# Altium schematic sheet Connectors.SchDoc
size A4
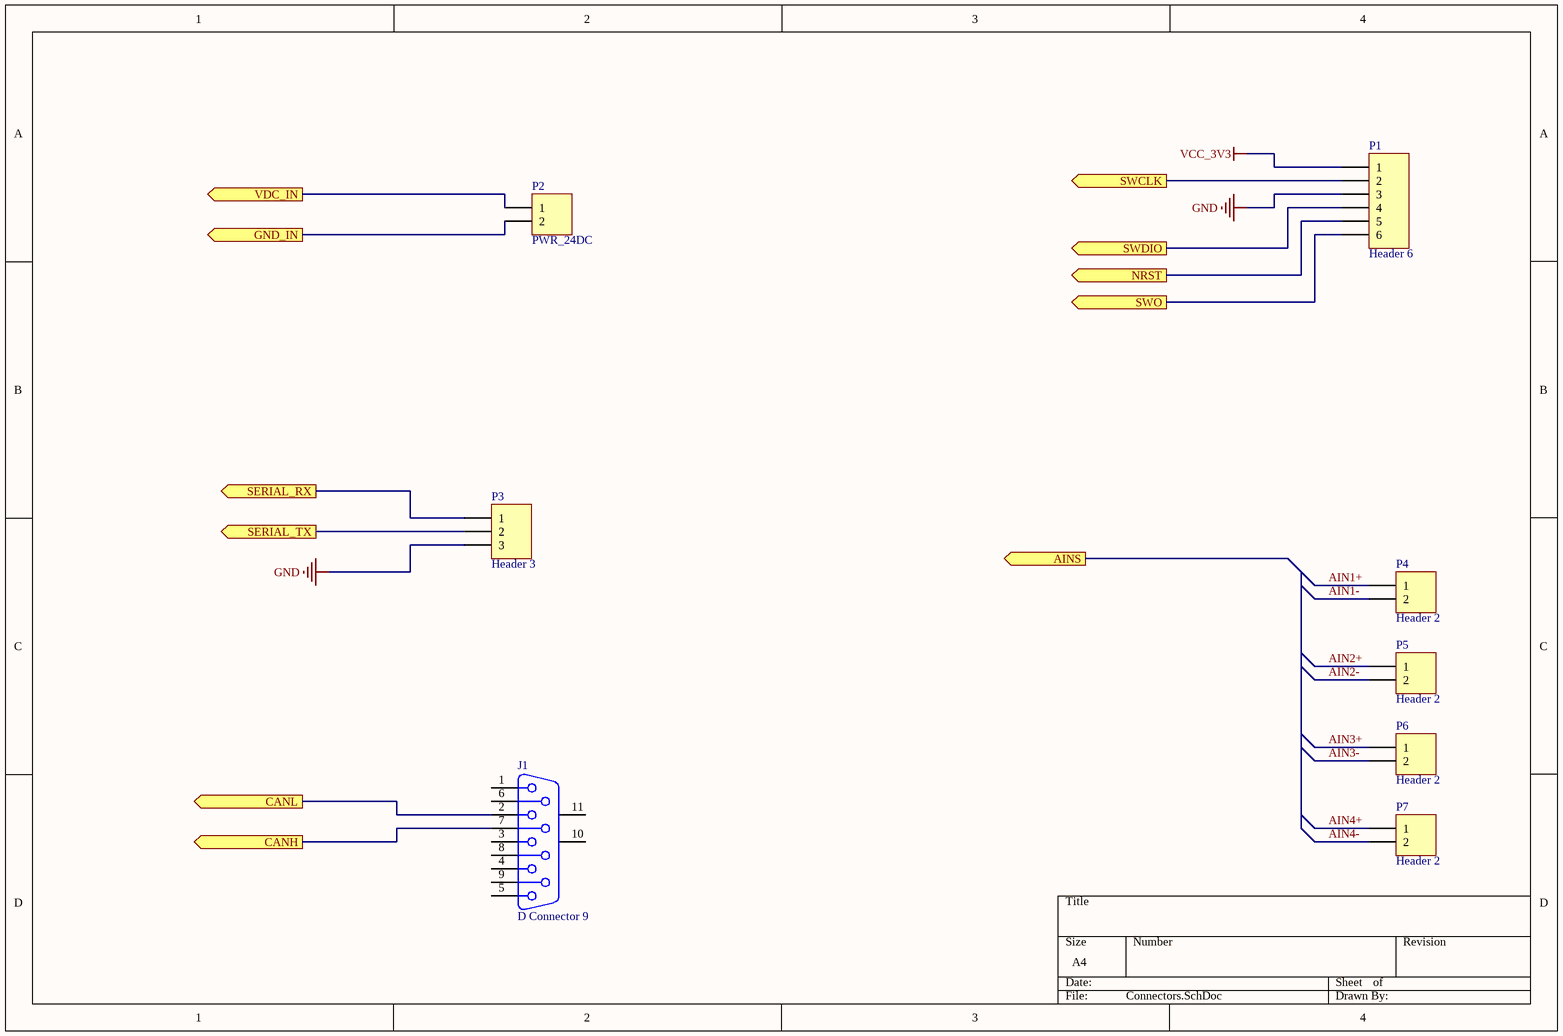
[diagram p0: Connectors.SchDoc]

## Parts
J1  D Connector 9  [DSUB1.385-2H9]
P1  Header 6  [HDR1X6]
P2  PWR_24DC  [HDR1X2]
P3  Header 3  [HDR1X3]
P4  Header 2  [HDR1X2]
P5  Header 2  [HDR1X2]
P6  Header 2  [HDR1X2]
P7  Header 2  [HDR1X2]

## Ports
AINS (out), CANH (out), CANL (out), GND_IN (out), NRST (out), SERIAL_RX (out), SERIAL_TX (out), SWCLK (out), SWDIO (out), SWO (out), VDC_IN (out)

## Nets
GND: P1.3 P3.3
VCC_3V3: P1.1
AIN1+: P4.1
AIN1-: P4.2
AIN2+: P5.1
AIN2-: P5.2
AIN3+: P6.1
AIN3-: P6.2
AIN4+: P7.1
AIN4-: P7.2
CANH: J1.7 ; port CANH
CANL: J1.2 ; port CANL
GND_IN: P2.2 ; port GND_IN
NRST: P1.5 ; port NRST
SERIAL_RX: P3.1 ; port SERIAL_RX
SERIAL_TX: P3.2 ; port SERIAL_TX
SWCLK: P1.2 ; port SWCLK
SWDIO: P1.4 ; port SWDIO
SWO: P1.6 ; port SWO
VDC_IN: P2.1 ; port VDC_IN

Not connected (* = marked no-connect by the designer): J1 1 3 4 5 6 8 9 10(MH1) 11(MH2)

## Library data of the parts
J1 = D Connector 9: Receptacle Assembly, 9 Position, Right Angle; PackageDocument: O; Positions: 9; Published: 15-Jun-2001; LatestRevisionDate: 17-Jul-2002; LatestRevisionNote: Re-released for DXP Platform.; DatasheetDocument: 1-Sep-1999; PackageReference: 788750; Publisher: Altium Limited; Orientation: Right Angle; Gender: Receptacle
P1 = Header 6: Header, 6-Pin; LatestRevisionDate: 17-Jul-2002; LatestRevisionNote: Re-released for DXP Platform.; Publisher: Altium Limited
P2 = Header 2: 2-Pin Connector; LatestRevisionDate: 17-Jul-2002; LatestRevisionNote: Re-released for DXP Platform.; Publisher: Altium Limited
P3 = Header 3: Header, 3-Pin; LatestRevisionDate: 17-Jul-2002; LatestRevisionNote: Re-released for DXP Platform.; Publisher: Altium Limited
P4-P7 = Header 2: Header, 2-Pin; LatestRevisionDate: 17-Jul-2002; LatestRevisionNote: Re-released for DXP Platform.; Publisher: Altium Limited